# EAGLE design BCI_Controller (EAGLE 9.6.2)
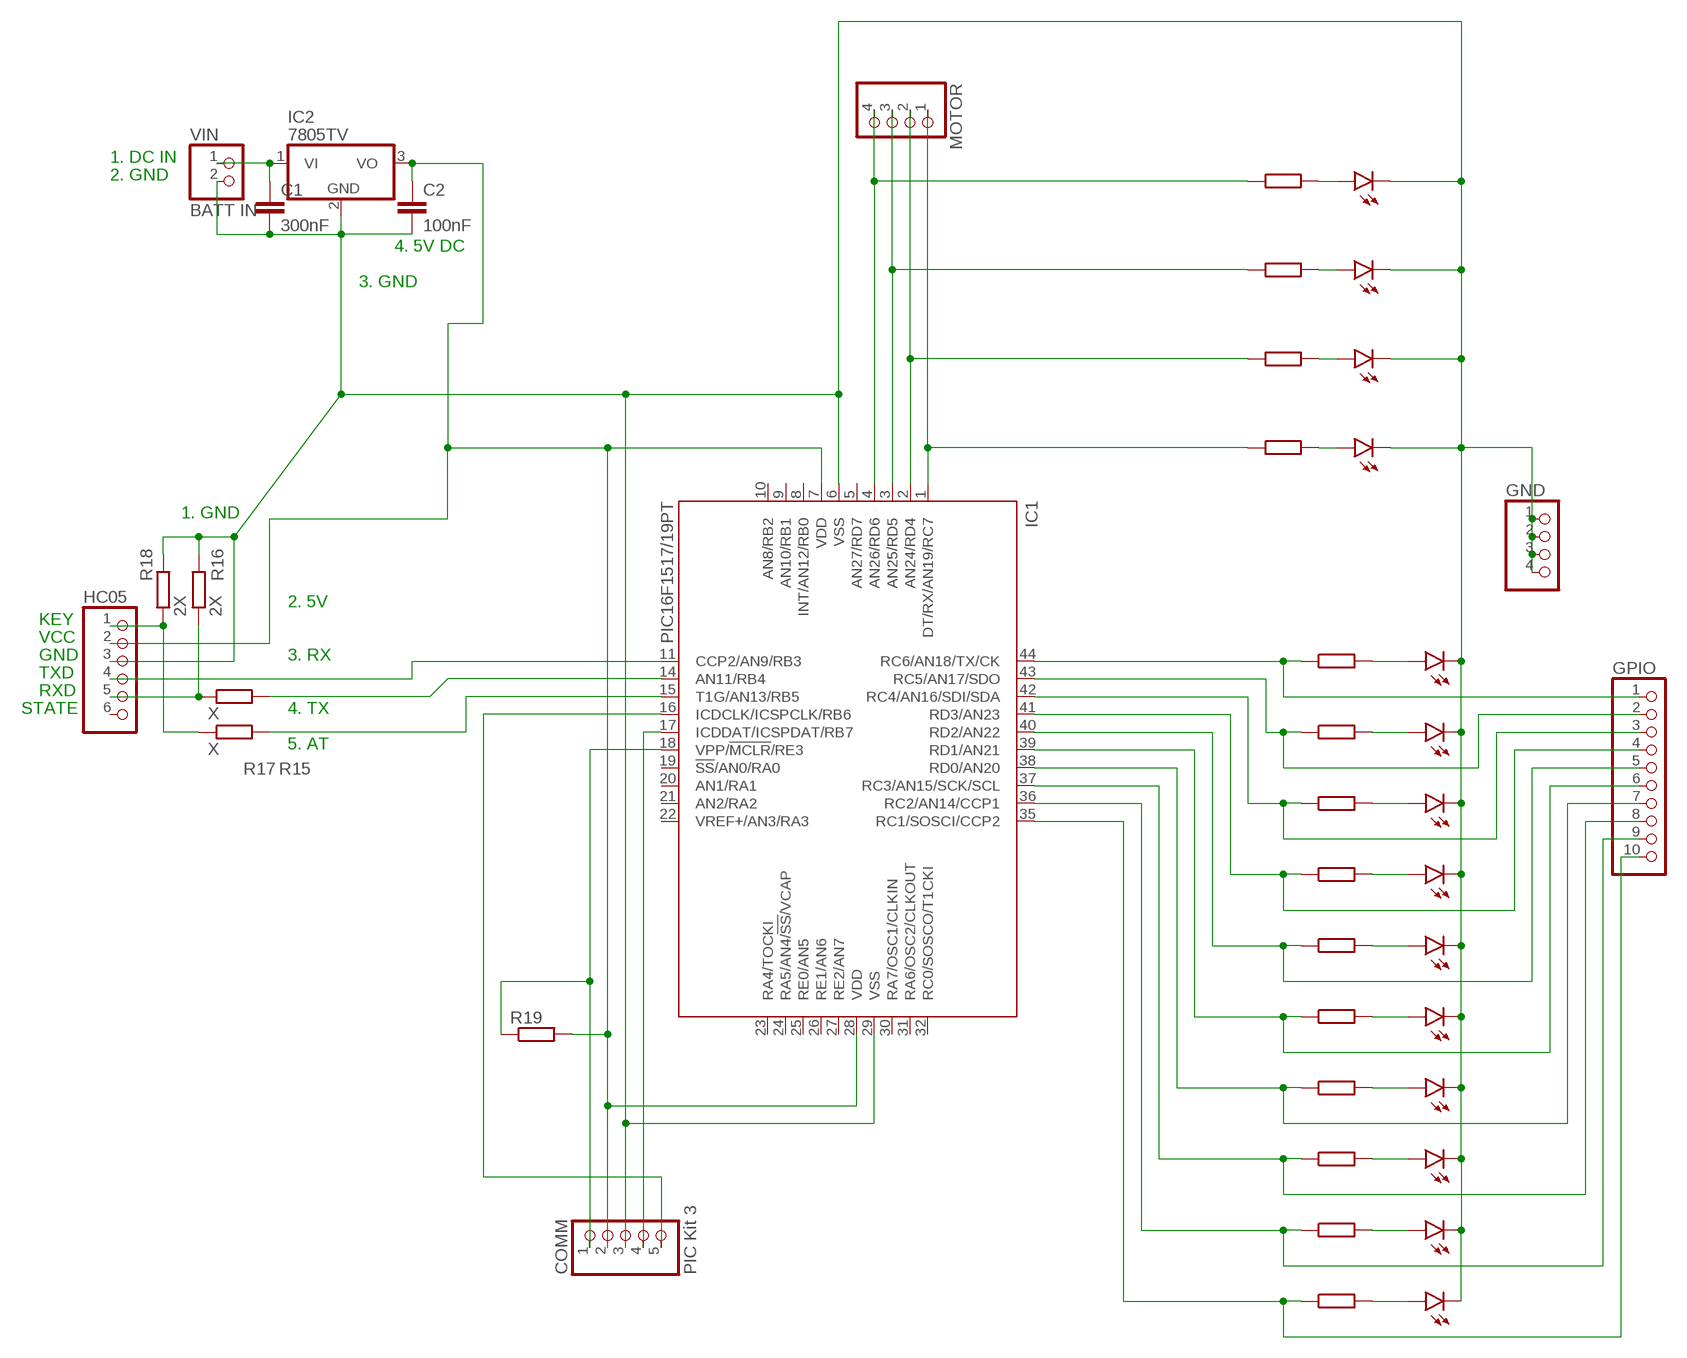
[diagram p0: schematic, sheet 1]

## Parts
C1  300nF  C-EUC1206  [C1206]
C2  100nF  C-EUC1206  [C1206]
COMM  PIC Kit 3  PINHD-1X5  [1X05]
GND  PINHD-1X4  [1X04]
GPIO  PINHD-1X10  [1X10]
HC05  PINHD-1X6  [1X06]
IC1  PIC16F1517/19PT  [TQFP44]
IC2  7805TV  [TO220V]
LED1  LEDSMT1206  [1206]
LED2  LEDSMT1206  [1206]
LED3  LEDSMT1206  [1206]
LED4  LEDSMT1206  [1206]
LED5  LEDSMT1206  [1206]
LED6  LEDSMT1206  [1206]
LED7  LEDSMT1206  [1206]
LED8  LEDSMT1206  [1206]
LED9  LEDSMT1206  [1206]
LED10  LEDSMT1206  [1206]
LED11  LEDSMT1206  [1206]
LED12  LEDSMT1206  [1206]
LED13  LEDSMT1206  [1206]
LED14  LEDSMT1206  [1206]
MOTOR  PINHD-1X4  [1X04]
R1  R-EU_R1206  [R1206]
R2  R-EU_R1206  [R1206]
R3  R-EU_R1206  [R1206]
R4  R-EU_R1206  [R1206]
R5  R-EU_R1206  [R1206]
R6  R-EU_R1206  [R1206]
R7  R-EU_R1206  [R1206]
R8  R-EU_R1206  [R1206]
R9  R-EU_R1206  [R1206]
R10  R-EU_R1206  [R1206]
R11  R-EU_R1206  [R1206]
R12  R-EU_R1206  [R1206]
R13  R-EU_R1206  [R1206]
R14  R-EU_R1206  [R1206]
R15  X  R-EU_M1206  [M1206]
R16  2X  R-EU_M1206  [M1206]
R17  X  R-EU_M1206  [M1206]
R18  2X  R-EU_M1206  [M1206]
R19  R-EU_M1206  [M1206]
VIN  BATT IN  PINHD-1X2  [1X02]

## Nets
N$1: C1.1 IC2.1(VI) VIN.1
N$2: COMM.4 IC1.17(ICDDAT/ICSPDAT/RB7)
N$4: LED1.A R1.2
N$5: LED2.A R2.2
N$6: COMM.5 IC1.16(ICDCLK/ICSPCLK/RB6)
N$7: GPIO.1 IC1.44(RC6/AN18/TX/CK) R1.1
N$8: GPIO.2 IC1.43(RC5/AN17/SDO) R2.1
N$9: GPIO.3 IC1.42(RC4/AN16/SDI/SDA) R3.1
N$10: GPIO.4 IC1.41(RD3/AN23) R4.1
N$11: GPIO.5 IC1.40(RD2/AN22) R5.1
N$12: GPIO.6 IC1.39(RD1/AN21) R6.1
N$13: GPIO.7 IC1.38(RD0/AN20) R7.1
N$14: GPIO.8 IC1.37(RC3/AN15/SCK/SCL) R8.1
N$15: GPIO.9 IC1.36(RC2/AN14/CCP1) R9.1
N$16: GPIO.10 IC1.35(RC1/SOSCI/CCP2) R10.1
N$17: LED3.A R3.2
N$18: LED4.A R4.2
N$19: LED5.A R5.2
N$20: LED6.A R6.2
N$21: LED7.A R7.2
N$22: LED8.A R8.2
N$23: LED9.A R9.2
N$24: LED10.A R10.2
N$25: HC05.5 R15.1 R16.1
N$26: IC1.14(AN11/RB4) R15.2
N$27: IC1.3(AN25/RD5) MOTOR.3 R12.1
N$28: IC1.4(AN26/RD6) MOTOR.4 R11.1
N$29: LED14.A R11.2
N$30: LED13.A R12.2
N$31: LED12.A R13.2
N$32: LED11.A R14.2
N$33: IC1.2(AN24/RD4) MOTOR.2 R13.1
N$34: IC1.1(DT/RX/AN19/RC7) MOTOR.1 R14.1
N$36: HC05.1 R17.1 R18.1
N$37: C2.1 COMM.2 HC05.2 IC1.7(VDD) IC1.28(VDD) IC2.3(VO) R19.2
N$38: IC1.15(T1G/AN13/RB5) R17.2
N$39: COMM.1 IC1.18(VPP/!MCLR!/RE3) R19.1
N$40: HC05.4 IC1.11(CCP2/AN9/RB3)
N$41: C1.2 C2.2 COMM.3 GND.1 GND.2 GND.3 GND.4 HC05.3 IC1.6(VSS) IC1.29(VSS) IC2.2(GND) LED1.C LED2.C LED3.C LED4.C LED5.C LED6.C LED7.C LED8.C LED9.C LED10.C LED11.C LED12.C LED13.C LED14.C R16.2 R18.2 VIN.2
Unconnected: HC05.6 IC1.5(AN27/RD7) IC1.8(INT/AN12/RB0) IC1.9(AN10/RB1) IC1.10(AN8/RB2) IC1.19(!SS!/AN0/RA0) IC1.20(AN1/RA1) IC1.21(AN2/RA2) IC1.22(VREF+/AN3/RA3) IC1.23(RA4/TOCKI) IC1.24(RA5/AN4/!SS!/VCAP) IC1.25(RE0/AN5) IC1.26(RE1/AN6) IC1.27(RE2/AN7) IC1.30(RA7/OSC1/CLKIN) IC1.31(RA6/OSC2/CLKOUT) IC1.32(RC0/SOSCO/T1CKI)

## Notes on the sheet
- 1. DC IN
- 2. GND
- 4. 5V DC
- 3. GND
- 1. GND
- 2. 5V
- KEY
- VCC
- GND | 3. RX
- TXD
- RXD
- STATE | 4. TX
- 5. AT

## Library data of the parts
C1 C2 = rcl:C-EU: CAPACITOR, European symbol; SPICEPREFIX: C
COMM = pinhead:PINHD-1X5: PIN HEADER
GND MOTOR = pinhead:PINHD-1X4: PIN HEADER
GPIO = pinhead:PINHD-1X10: PIN HEADER
HC05 = pinhead:PINHD-1X6: PIN HEADER
IC1 = microchip:PIC16*F1517/19: 28/40/44-Pin Flash Microcontrollers with nanoWatt XLP Technology PIC16F1517/1519 AND PIC16LF1517/1519 Source: www.microchip.com PIC16F1516.pdf
IC2 = linear:78*: Positive VOLTAGE REGULATOR Source: http://cache.national.com/ds/LM/LM78L05.pdf http://www.fairchildsemi.com/ds/LM/LM7805.pdf
LED1-LED14 = led:LED: LED OSRAM: - CHIPLED LG R971, LG N971, LY N971, LG Q971, LY Q971, LO R971, LY R971 LH N974, LH R974 LS Q976, LO Q976, LY Q976 LO Q996 - Hyper CHIPLED LW Q18S LB Q993, LB Q99A, LB R99A - SideLED LS A670, LO A670, LY A670, LG A670, LP A670 LB A673, LV A673, LT A673, LW A673 LH A674 LY A675 LS A676, LA A676, LO A676, LY A676, LW A676 LS A679, LY A679, LG A679 - Hyper Micro SIDELED® LS Y876, LA Y876, LO Y876, LY Y876 LT Y87S - SmartLED LW L88C, LW L88S LB L89C, LB L89S, LG L890 LS L89K, LO L89K, LY L89K LS L896, LA L896, LO L896, LY L896 - TOPLED LS T670, LO T670, LY T670, LG T670, LP T670 LSG T670, LSP T670, LSY T670, LOP T670, LYG T670 LG T671, LOG T671, LSG T671 LB T673, LV T673, LT T673, LW T673 LH T674 LS T676, LA T676, LO T676, LY T676, LB T676, LH T676, LSB T676, LW T676 LB T67C, LV T67C, LT T67C, LS T67K, LO T67K, LY T67K, LW E67C LS E67B, LA E67B, LO E67B, LY E67B, LB E67C, LV E67C, LT E67C LW T67C LS T679, LY T679, LG T679 LS T770, LO T770, LY T770, LG T770, LP T770 LB T773, LV T773, LT T773, LW T773 LH T774 LS E675, LA E675, LY E675, LS T675 LS T776, LA T776, LO T776, LY T776, LB T776 LHGB T686 LT T68C, LB T68C - Hyper Mini TOPLED® LB M676 - Mini TOPLED Santana® LG M470 LS M47K, LO M47K, LY M47K Source: http://www.osram.convergy.de LUXEON: - LUMILED® LXK2-PW12-R00, LXK2-PW12-S00, LXK2-PW14-U00, LXK2-PW14-V00 LXK2-PM12-R00, LXK2-PM12-S00, LXK2-PM14-U00 LXK2-PE12-Q00, LXK2-PE12-R00, LXK2-PE12-S00, LXK2-PE14-T00, LXK2-PE14-U00 LXK2-PB12-K00, LXK2-PB12-L00, LXK2-PB12-M00, LXK2-PB14-N00, LXK2-PB14-P00, LXK2-PB14-Q00 LXK2-PR12-L00, LXK2-PR12-M00, LXK2-PR14-Q00, LXK2-PR14-R00 LXK2-PD12-Q00, LXK2-PD12-R00, LXK2-PD12-S00 LXK2-PH12-R00, LXK2-PH12-S00 LXK2-PL12-P00, LXK2-PL12-Q00, LXK2-PL12-R00 Source: www.luxeon.com KINGBRIGHT: KA-3528ASYC Source: www.kingbright.com
R1-R19 = rcl:R-EU_: RESISTOR, European symbol; SPICEPREFIX: R
VIN = pinhead:PINHD-1X2: PIN HEADER

## Board
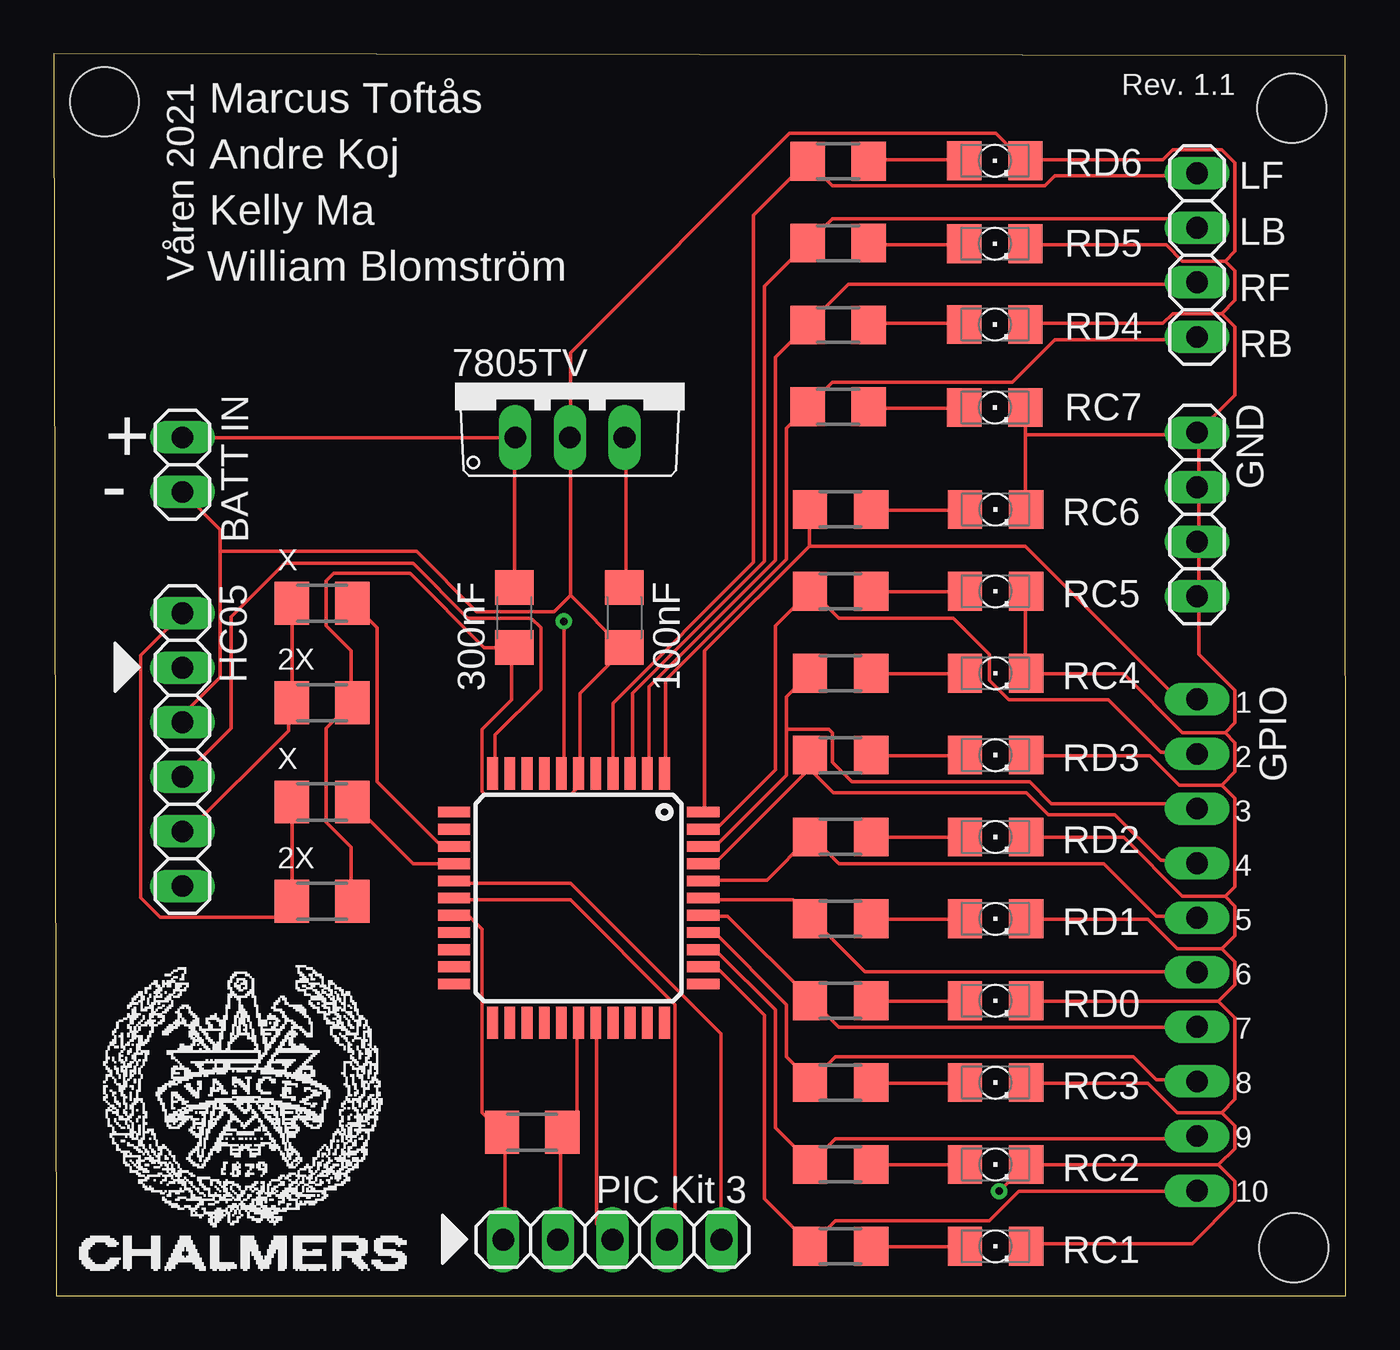
[diagram p1: board, top side]
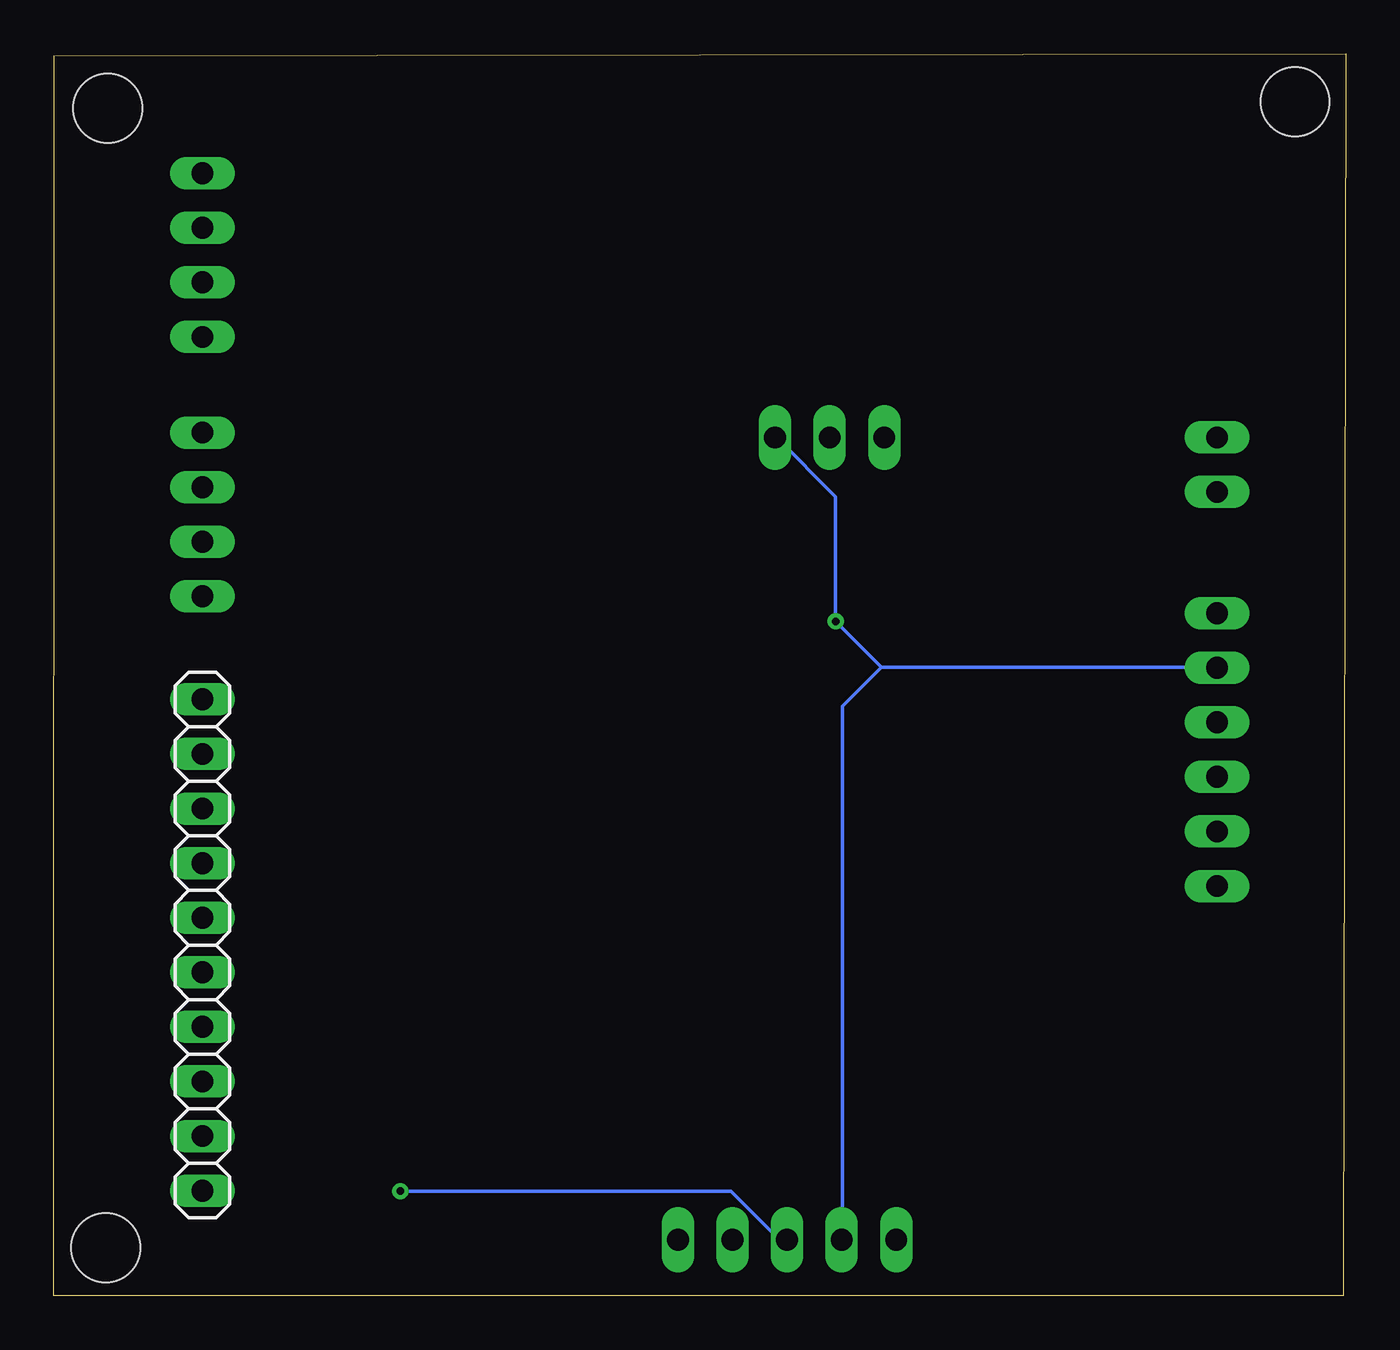
[diagram p2: board, bottom side, seen from below]

Size 60.15 x 57.81 mm. Coordinates in mm from the lower left corner, seen from the top.
Outline: 0.13,0 60.15,0 60.12,57.71 0,57.81 0.13,0
Copper layers (1*16): Top 0.035mm / dielectric 1.5mm / Bottom 0.035mm
Design rules "default": minimum track width 6mil, minimum drill 0.35mm, track to track 6mil, track to pad 6mil, pad to pad 6mil, via to via 6mil, smd to smd 6mil, copper to edge 40mil, drill to drill 6mil, minimum pad ring 10mil, minimum via ring 8mil, stop-mask expansion 4mil, vias tented up to drill 0mil, thermal gap 10mil
Holes 3.2 mm at 2.36,55.58 57.63,55.27 57.73,2.24

### Footprints (pad centres in the part's own frame; a part is rotated, then mirrored left to right if it is on the bottom)
C1206 = smd 1.6 x 1.8: 1 -1.4,0; 2 1.4,0
1X05 = drill 1.016 long: 1 -5.08,0; 2 -2.54,0; 3 0,0; 4 2.54,0; 5 5.08,0
1X04 = drill 1.016 long: 1 -3.81,0; 2 -1.27,0; 3 1.27,0; 4 3.81,0
1X10 = drill 1.016 long: 1 -11.43,0; 2 -8.89,0; 3 -6.35,0; 4 -3.81,0; 5 -1.27,0; 6 1.27,0; 7 3.81,0; 8 6.35,0; 9 8.89,0; 10 11.43,0
1X06 = drill 1.016 long: 1 -6.35,0; 2 -3.81,0; 3 -1.27,0; 4 1.27,0; 5 3.81,0; 6 6.35,0
TQFP44 = smd 1.5 x 0.5: 1 -5.8,4; 2 -5.8,3.2; 3 -5.8,2.4; 4 -5.8,1.6; 5 -5.8,0.8; 6 -5.8,0; 7 -5.8,-0.8; 8 -5.8,-1.6; 9 -5.8,-2.4; 10 -5.8,-3.2; 11 -5.8,-4; 23 5.8,-4; 24 5.8,-3.2; 25 5.8,-2.4; 26 5.8,-1.6; 27 5.8,-0.8; 28 5.8,0; 29 5.8,0.8; 30 5.8,1.6; 31 5.8,2.4; 32 5.8,3.2; 33 5.8,4 | smd 0.5 x 1.5: 12 -4,-5.8; 13 -3.2,-5.8; 14 -2.4,-5.8; 15 -1.6,-5.8; 16 -0.8,-5.8; 17 0,-5.8; 18 0.8,-5.8; 19 1.6,-5.8; 20 2.4,-5.8; 21 3.2,-5.8; 22 4,-5.8; 34 4,5.8; 35 3.2,5.8; 36 2.4,5.8; 37 1.6,5.8; 38 0.8,5.8; 39 0,5.8; 40 -0.8,5.8; 41 -1.6,5.8; 42 -2.4,5.8; 43 -3.2,5.8; 44 -4,5.8
TO220V = drill 1.016 long: 1 -2.54,-2.54; 2 0,-2.54; 3 2.54,-2.54
1206 = smd 1.6 x 1.803: A -1.422,0; C 1.422,0
R1206 = smd 1.6 x 1.803: 1 -1.422,0; 2 1.422,0
M1206 = smd 1.6 x 2: 1 -1.4,0; 2 1.4,0
1X02 = drill 1.016 long: 1 -1.27,0; 2 1.27,0

### Placement (x,y rotation side)
C1  21.44,31.57 270 top
C2  26.57,31.57 270 top
COMM  26.01,2.62 0 top
GND  53.23,36.37 270 top
GPIO  53.23,16.33 270 bottom
HC05  5.99,25.43 270 top
IC1  24.43,18.52 270 top
IC2  24.03,42.49 0 top
LED1  43.84,36.6 0 top
LED2  43.84,32.79 0 top
LED3  43.84,28.98 0 top
LED4  43.84,25.17 0 top
LED5  43.84,21.36 0 top
LED6  43.84,17.55 0 top
LED7  43.84,13.74 0 top
LED8  43.84,9.93 0 top
LED9  43.84,6.12 0 top
LED10  43.84,2.31 0 top
LED11  43.82,41.35 0 top
LED12  43.82,45.21 0 top
LED13  43.82,48.97 0 top
LED14  43.82,52.83 0 top
MOTOR  53.23,48.44 90 top
R1  36.63,36.6 0 top
R2  36.63,32.79 0 top
R3  36.63,28.98 0 top
R4  36.63,25.17 0 top
R5  36.63,21.36 0 top
R6  36.63,17.55 0 top
R7  36.63,13.74 0 top
R8  36.63,9.93 0 top
R9  36.63,6.12 0 top
R10  36.63,2.31 0 top
R11  36.53,52.81 0 top
R12  36.53,49 0 top
R13  36.53,45.19 0 top
R14  36.53,41.38 0 top
R15  12.5,32.23 0 top
R16  12.5,27.61 0 top
R17  12.5,22.99 0 top
R18  12.5,18.36 0 top
R19  22.28,7.62 0 top
VIN  5.99,38.68 270 top

### Tracks (layer width: path | path; a pad name or v marks a point on that pad's centre or on a via)
N$1
  Top 0.152: 21.46,39.93 21.46,33.07 C1.1 | 21.46,39.93 6.07,39.93 VIN.1 | 21.46,39.93 IC2.1
N$2
  Top 0.152: IC1.17 18.72,18.44 24.05,18.44 28.93,13.56 28.93,3.05 28.63,2.74 COMM.4
N$4
  Top 0.152: R1.2 38.08,36.58 42.34,36.58 LED1.A
N$5
  Top 0.152: R2.2 38.08,32.77 42.34,32.77 LED2.A
N$6
  Top 0.152: IC1.16 18.72,19.2 24.05,19.2 31.06,12.19 31.06,2.74 COMM.5
N$7
  Top 0.152: 35.18,34.9 30.3,30.02 30.3,22.55 IC1.44 | 35.18,34.9 35.18,36.58 R1.1 | 35.18,34.9 45.24,34.9 52.25,27.89 53.16,27.89 GPIO.1
N$8
  Top 0.152: IC1.43 30.3,21.79 30.91,21.79 33.6,24.49 33.6,31.19 35.18,32.77 R2.1 35.33,32.77 36.55,31.55 41.89,31.55 43.56,29.87 43.56,28.65 44.48,27.74 49.1,27.74 51.54,25.3 53.16,25.3 GPIO.2
N$9
  Top 0.152: 34.11,26.36 34.11,27.89 35.18,28.96 R3.1 | 34.11,26.36 34.11,24.23 30.91,21.03 30.3,21.03 IC1.42 | 34.11,26.36 36.09,26.36 36.25,26.21 36.25,24.84 37.16,23.93 45.44,23.93 46.46,22.91 52.65,22.91 GPIO.3
N$10
  Top 0.152: 35.18,24.54 30.76,20.12 30.3,20.12 IC1.41 | 35.18,24.54 35.18,25.15 R4.1 35.18,24.54 | 35.18,24.54 36.3,23.42 45.29,23.42 46.3,22.4 49.4,22.4 51.54,20.27 53.16,20.27 GPIO.4
N$11
  Top 0.152: IC1.40 30.3,19.36 33.2,19.36 35.18,21.34 R5.1 35.33,21.34 36.55,20.12 48.9,20.12 51.33,17.68 53.16,17.68 GPIO.5
N$12
  Top 0.152: IC1.39 30.3,18.44 34.42,18.44 35.18,17.68 R6.1 35.33,17.53 37.77,15.09 53.16,15.09 GPIO.6
N$13
  Top 0.152: IC1.38 30.3,17.68 31.37,17.68 35.18,13.87 R7.1 35.33,13.72 36.55,12.5 53.16,12.5 GPIO.7
N$14
  Top 0.152: IC1.37 30.3,16.92 30.76,16.92 34.11,13.56 34.11,11.12 35.18,10.06 R8.1 35.33,10.06 36.4,11.12 50.27,11.12 51.33,10.06 53.16,10.06 GPIO.8
N$15
  Top 0.152: IC1.36 30.3,16 30.91,16 33.6,13.31 33.6,7.82 35.18,6.25 R9.1 35.33,6.25 36.4,7.32 53.16,7.32 GPIO.9
N$16
  Top 0.152: IC1.35 30.3,15.24 30.91,15.24 33.1,13.06 33.1,4.52 35.18,2.44 R10.1 35.33,2.44 36.4,3.5 43.56,3.5 44.93,4.88 53.16,4.88 GPIO.10
N$17
  Top 0.152: R3.2 38.08,28.96 42.34,28.96 LED3.A
N$18
  Top 0.152: R4.2 38.08,25.15 42.34,25.15 LED4.A
N$19
  Top 0.152: R5.2 38.08,21.34 42.34,21.34 LED5.A
N$20
  Top 0.152: R6.2 38.08,17.53 42.34,17.53 LED6.A
N$21
  Top 0.152: R7.2 38.08,13.72 42.34,13.72 LED7.A
N$22
  Top 0.152: R8.2 38.08,9.91 42.34,9.91 LED8.A
N$23
  Top 0.152: R9.2 38.08,6.1 42.34,6.1 LED9.A
N$24
  Top 0.152: R10.2 38.08,2.29 42.34,2.29 LED10.A
N$25
  Top 0.152: HC05.5 6.25,21.61 10.95,26.31 10.95,27.58 R16.1 11.1,27.74 11.1,32.16 R15.1
N$26
  Top 0.152: IC1.14 18.57,21.03 17.96,21.03 15.06,23.93 15.06,31.09 14,32.16 R15.2
N$27
  Top 0.152: IC1.3 26.95,24.38 26.95,28.04 33.1,34.19 33.1,46.99 35.03,48.92 R12.1 35.18,49.07 36.25,50.14 53.01,50.14 MOTOR.3
N$28
  Top 0.152: IC1.4 26.04,24.38 26.04,27.58 32.59,34.14 32.59,50.29 35.03,52.73 R11.1 35.18,52.73 36.25,51.66 46.15,51.66 46.61,52.12 53.16,52.12 MOTOR.4
N$29
  Top 0.152: R11.2 38.08,52.88 42.34,52.88 LED14.A
N$30
  Top 0.152: LED13.A 42.34,48.92 38.08,48.92 R12.2
N$31
  Top 0.152: R13.2 38.08,45.26 42.34,45.26 LED12.A
N$32
  Top 0.152: LED11.A 42.34,41.3 38.08,41.3 R14.2
N$33
  Top 0.152: IC1.2 27.71,24.38 27.71,28.35 33.6,34.24 33.6,43.69 35.03,45.11 R13.1 35.18,45.26 37.01,47.09 53.16,47.09 MOTOR.2
N$34
  Top 0.152: IC1.1 28.47,24.38 28.47,28.65 34.11,34.29 34.11,40.39 35.03,41.3 R14.1 35.18,41.45 36.25,42.52 44.63,42.52 46.61,44.5 53.16,44.5 MOTOR.1
N$36
  Top 0.152: 11.1,18.44 11.1,22.86 R17.1 | 11.1,18.44 11.1,17.63 4.95,17.63 4.04,18.54 4.04,29.82 HC05.1 | 11.1,18.44 R18.1
N$37  (via drill 0.35)
  Top 0.152: IC1.28 24.36,12.65 24.36,8.23 23.75,7.62 R19.2 23.6,7.62 23.6,2.74 COMM.2 | v23.75,31.39 23.75,24.38 IC1.7 | C2.1 26.64,33.07 26.64,39.93 IC2.3
  Bottom 0.152: IC2.3 26.49,39.93 23.75,37.19 v23.75,31.39 21.61,29.26 | 21.61,29.26 6.07,29.26 HC05.2 | 21.61,29.26 23.44,27.43 23.44,2.74 COMM.2
N$38
  Top 0.152: IC1.15 18.57,20.12 16.74,20.12 14,22.86 R17.2
N$39
  Top 0.152: IC1.18 18.72,17.68 19.33,17.68 19.94,17.07 19.94,8.53 20.85,7.62 R19.1 21.01,7.62 21.01,2.74 COMM.1
N$40
  Top 0.152: HC05.4 8.26,26.42 8.26,31.6 10.74,34.09 16.74,34.09 19.28,31.55 22.22,31.55 22.68,31.09 22.68,28.25 20.55,26.11 20.55,24.38 IC1.11
N$41  (via drill 0.35)
  Top 0.152: 7.75,34.65 7.75,35.66 VIN.2 | 7.75,34.65 7.75,28.8 6.07,27.13 6.07,26.82 HC05.3 | R18.2 13.84,18.44 13.84,20.88 12.68,22.05 12.68,26.42 13.84,27.58 R16.2 13.84,27.74 13.84,30.02 12.68,31.19 12.68,33.27 13.03,33.63 16.59,33.63 20.04,30.18 21.31,30.18 C1.2 21.31,30.02 21.31,27.74 19.94,26.36 19.94,23.47 20.09,23.32 24.05,23.32 24.36,23.62 24.36,24.23 IC1.6 24.51,24.38 24.51,28.04 26.49,30.02 C2.2 26.49,30.18 24.05,32.61 | 24.05,32.61 24.05,39.93 IC2.2 24.05,40.08 24.05,43.89 34.27,54.1 43.87,54.1 45.09,52.88 LED14.C 45.24,52.88 51.64,52.88 52.1,53.34 54.38,53.34 54.99,52.73 54.99,48.62 54.53,48.16 | 7.75,34.65 16.89,34.65 19.68,31.85 23.29,31.85 24.05,32.61 | 45.24,40.08 45.24,36.73 LED1.C | 45.24,40.08 45.24,41.3 LED11.C | 54.38,45.72 52.1,45.72 51.64,45.26 45.24,45.26 LED12.C | 54.38,45.72 54.99,45.11 54.99,41.91 53.32,40.23 GND.1 | 54.53,48.16 52.55,48.16 51.79,48.92 45.24,48.92 LED13.C | 54.53,48.16 54.99,47.7 54.99,46.33 54.38,45.72 | 53.32,37.64 53.32,40.08 GND.1 | 45.24,40.08 53.16,40.08 GND.1 | 53.32,37.64 53.32,35.2 GND.3 53.32,35.05 53.32,32.61 GND.4 53.32,32.46 53.32,29.87 54.99,28.19 54.99,26.67 54.53,26.21 | 53.32,37.64 GND.2 | COMM.3 25.27,3.35 25.27,12.65 IC1.29 | LED2.C 45.24,32.77 45.24,29.11 LED3.C 45.39,28.96 49.81,28.96 52.55,26.21 54.53,26.21 | 54.23,6.1 54.99,5.33 54.99,4.42 53.01,2.44 45.39,2.44 LED10.C | 54.23,6.1 45.39,6.1 LED9.C 45.24,6.1 v44.02,4.88 | 54.38,8.53 52.3,8.53 50.93,9.91 45.39,9.91 LED8.C | 54.38,8.53 54.99,7.92 54.99,6.86 54.23,6.1 | 54.23,13.72 45.39,13.72 LED7.C | 54.23,13.72 54.99,12.95 54.99,9.14 54.38,8.53
  Top 0.152: 54.38,16.15 52.3,16.15 50.93,17.53 45.39,17.53 LED6.C | 54.38,16.15 54.99,15.54 54.99,14.48 54.23,13.72 | 54.53,18.59 52.55,18.59 49.81,21.34 45.39,21.34 LED5.C | 54.53,18.59 54.99,18.14 54.99,16.76 54.38,16.15 | 54.38,23.77 52.4,23.77 51.03,25.15 45.39,25.15 LED4.C | 54.38,23.77 54.99,23.16 54.99,19.05 54.53,18.59 | 54.53,26.21 54.99,25.76 54.99,24.38 54.38,23.77
  Bottom 0.152: v44.02,4.88 28.63,4.88 26.49,2.74 26.04,2.74 COMM.3

### Text on the board
tPlace: Rev. 1.1 | Marcus Toftås | Andre Koj | Kelly Ma | Våren 2021 | William Blomström | + | - | 1 | 2 | 3 | 4 | 5 | 6 | 7 | 8 | 9 | 10
tNames: RD6 | LF | LB | RD5 | RF | RD4 | RB | RC7 | RC6 | RC5 | RC4 | RD3 | RD2 | RD1 | RD0 | RC3 | RC2 | RC1